# EAGLE schematic Board (EAGLE 7.5.0)
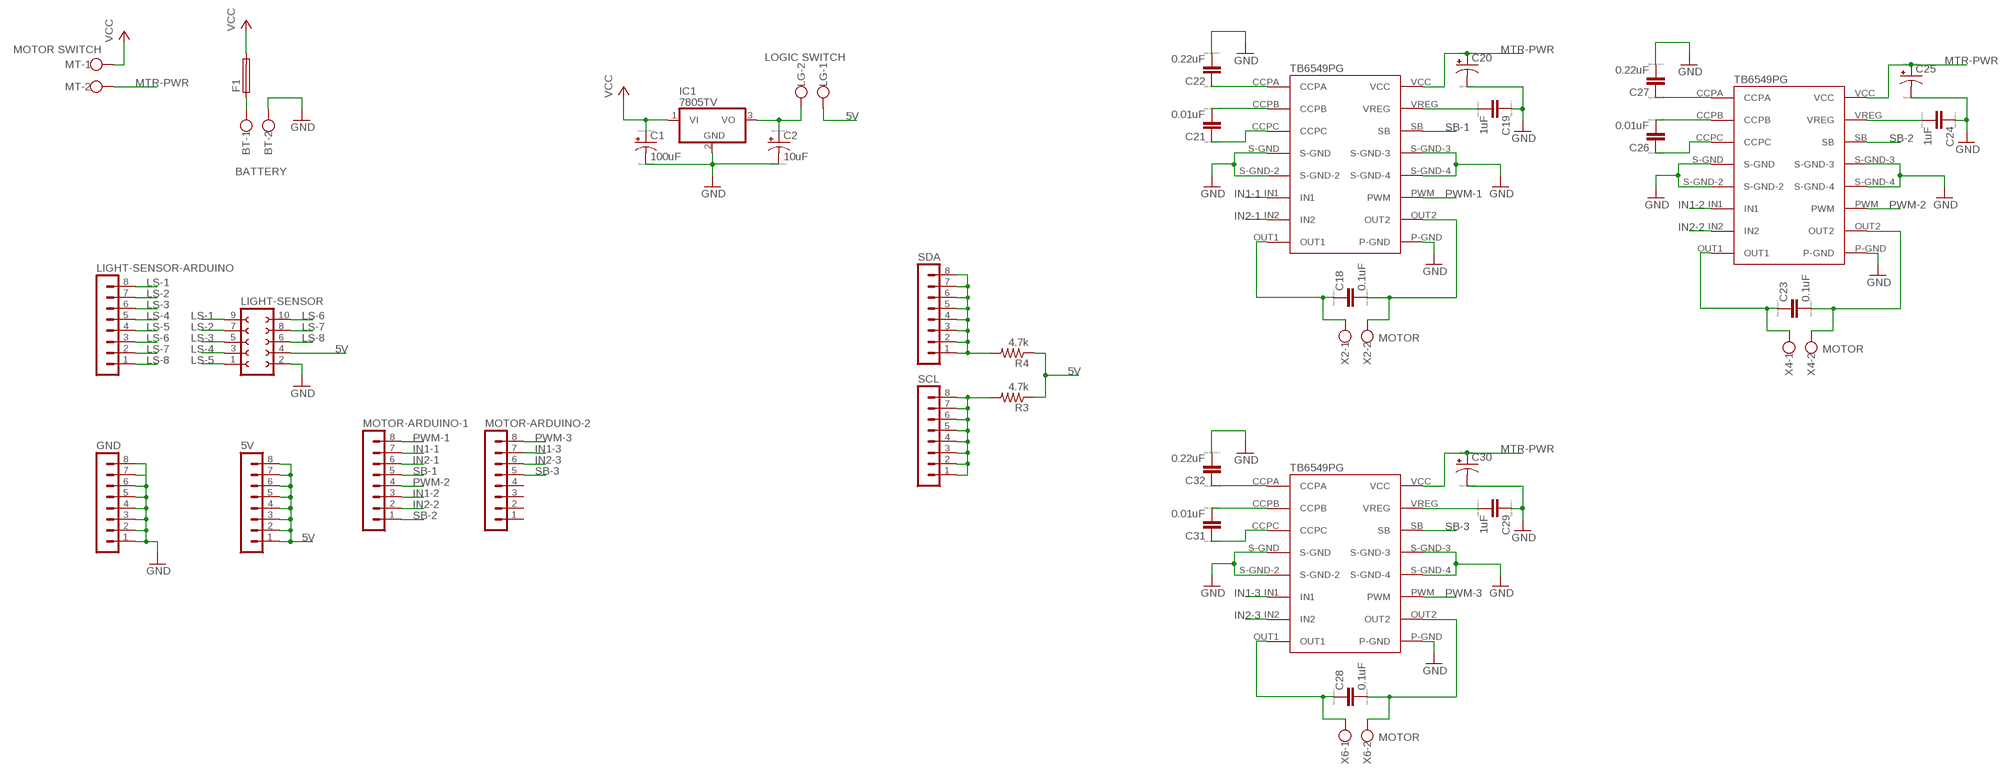
[diagram p0: schematic, sheet 1]

## Parts
5V  MA08-1  [MA08-1]
BT  W237-102  [W237-102]
C1  100uF  CPOL-USE3.5-8  [E3,5-8]
C2  10uF  CPOL-USE3.5-8  [E3,5-8]
C18  0.1uF  CYYC7B5  [YC7B5]
C19  1uF  CYYC7B5  [YC7B5]
C20  CPOL-USE3.5-8  [E3,5-8]
C21  0.01uF  CYYC7B5  [YC7B5]
C22  0.22uF  CYYC7B5  [YC7B5]
C23  0.1uF  CYYC7B5  [YC7B5]
C24  1uF  CYYC7B5  [YC7B5]
C25  CPOL-USE3.5-8  [E3,5-8]
C26  0.01uF  CYYC7B5  [YC7B5]
C27  0.22uF  CYYC7B5  [YC7B5]
C28  0.1uF  CYYC7B5  [YC7B5]
C29  1uF  CYYC7B5  [YC7B5]
C30  CPOL-USE3.5-8  [E3,5-8]
C31  0.01uF  CYYC7B5  [YC7B5]
C32  0.22uF  CYYC7B5  [YC7B5]
F1  GSH15  [GSH15]
GND  MA08-1  [MA08-1]
IC1  7805TV  [TO220V]
LG  W237-102  [W237-102]
LIGHT-SENSOR  FE05-2  [FE05-2]
LIGHT-SENSOR-ARDUINO  MA08-1  [MA08-1]
MOTOR-ARDUINO-1  MA08-1  [MA08-1]
MOTOR-ARDUINO-2  MA08-1  [MA08-1]
MT  W237-102  [W237-102]
R3  4.7k  R-US_0207/10  [0207/10]
R4  4.7k  R-US_0207/10  [0207/10]
SCL  MA08-1  [MA08-1]
SDA  MA08-1  [MA08-1]
U$4  TB6549PG  [TB6549PG]
U$5  TB6549PG  [TB6549PG]
U$6  TB6549PG  [TB6549PG]
X2  W237-102  [W237-102]
X4  W237-102  [W237-102]
X6  W237-102  [W237-102]

## Nets
1: C2.+ IC1.3(VO) LG.2
5V: 5V.1 5V.2 5V.3 5V.4 5V.5 5V.6 5V.7 5V.8 LG.1 LIGHT-SENSOR.4 R3.1 R4.1
GND: BT.2 C1.- C2.- C19.1 C20.- C22.2 C24.1 C25.- C27.2 C29.1 C30.- C32.2 GND.1 GND.2 GND.3 GND.4 GND.5 GND.6 GND.7 GND.8 IC1.2(GND) LIGHT-SENSOR.2 U$4.P-GND U$4.S-GND U$4.S-GND-2 U$4.S-GND-3 U$4.S-GND-4 U$5.P-GND U$5.S-GND U$5.S-GND-2 U$5.S-GND-3 U$5.S-GND-4 U$6.P-GND U$6.S-GND U$6.S-GND-2 U$6.S-GND-3 U$6.S-GND-4
IN1-1: MOTOR-ARDUINO-1.7 U$4.IN1
IN1-2: MOTOR-ARDUINO-1.3 U$5.IN1
IN1-3: MOTOR-ARDUINO-2.7 U$6.IN1
IN2-1: MOTOR-ARDUINO-1.6 U$4.IN2
IN2-2: MOTOR-ARDUINO-1.2 U$5.IN2
IN2-3: MOTOR-ARDUINO-2.6 U$6.IN2
LS-1: LIGHT-SENSOR-ARDUINO.8 LIGHT-SENSOR.9
LS-2: LIGHT-SENSOR-ARDUINO.7 LIGHT-SENSOR.7
LS-3: LIGHT-SENSOR-ARDUINO.6 LIGHT-SENSOR.5
LS-4: LIGHT-SENSOR-ARDUINO.5 LIGHT-SENSOR.3
LS-5: LIGHT-SENSOR-ARDUINO.4 LIGHT-SENSOR.1
LS-6: LIGHT-SENSOR-ARDUINO.3 LIGHT-SENSOR.10
LS-7: LIGHT-SENSOR-ARDUINO.2 LIGHT-SENSOR.8
LS-8: LIGHT-SENSOR-ARDUINO.1 LIGHT-SENSOR.6
MTR-PWR: C20.+ C25.+ C30.+ MT.2 U$4.VCC U$5.VCC U$6.VCC
N$3: BT.1 F1.1
N$5: R3.2 SCL.1 SCL.2 SCL.3 SCL.4 SCL.5 SCL.6 SCL.7 SCL.8
N$6: R4.2 SDA.1 SDA.2 SDA.3 SDA.4 SDA.5 SDA.6 SDA.7 SDA.8
N$24: C22.1 U$4.CCPA
N$25: C21.2 U$4.CCPB
N$26: C21.1 U$4.CCPC
N$27: C18.2 U$4.OUT2 X2.2
N$28: C18.1 U$4.OUT1 X2.1
N$29: C19.2 U$4.VREG
N$30: C27.1 U$5.CCPA
N$31: C26.2 U$5.CCPB
N$32: C26.1 U$5.CCPC
N$33: C23.2 U$5.OUT2 X4.2
N$34: C23.1 U$5.OUT1 X4.1
N$35: C24.2 U$5.VREG
N$36: C32.1 U$6.CCPA
N$37: C31.2 U$6.CCPB
N$38: C31.1 U$6.CCPC
N$39: C28.2 U$6.OUT2 X6.2
N$40: C28.1 U$6.OUT1 X6.1
N$41: C29.2 U$6.VREG
PWM-1: MOTOR-ARDUINO-1.8 U$4.PWM
PWM-2: MOTOR-ARDUINO-1.4 U$5.PWM
PWM-3: MOTOR-ARDUINO-2.8 U$6.PWM
SB-1: MOTOR-ARDUINO-1.5 U$4.SB
SB-2: MOTOR-ARDUINO-1.1 U$5.SB
SB-3: MOTOR-ARDUINO-2.5 U$6.SB
VCC: C1.+ F1.2 IC1.1(VI) MT.1
Unconnected: MOTOR-ARDUINO-2.1 MOTOR-ARDUINO-2.2 MOTOR-ARDUINO-2.3 MOTOR-ARDUINO-2.4

## Notes on the sheet
- MOTOR SWITCH | LOGIC SWITCH
- BATTERY
- MOTOR
- MOTOR
- MOTOR

## Library data of the parts
5V GND LIGHT-SENSOR-ARDUINO MOTOR-ARDUINO-1 MOTOR-ARDUINO-2 SCL SDA = con-lstb:MA08-1: PIN HEADER; OC_FARNELL: unknown; OC_NEWARK: unknown
BT LG MT X2 X4 X6 = con-wago-500:W237-102: WAGO SCREW CLAMP; MPN: 237-102; OC_FARNELL: unknown; OC_NEWARK: 70K9898
C1 C2 C20 C25 C30 = resistor:CPOL-US: POLARIZED CAPACITOR, American symbol
C18 C19 C21-C24 C26-C29 C31 C32 = resistor:CY: Y CAPACITOR for power line
F1 = fuse:GSH15: FUSE HOLDER grid 15mm, 19649 Wickmann; MPN: 64900001039; OC_FARNELL: 1271673; OC_NEWARK: 02P0318
IC1 = linear:78*: Positive VOLTAGE REGULATOR Source: http://cache.national.com/ds/LM/LM78L05.pdf http://www.fairchildsemi.com/ds/LM/LM7805.pdf
LIGHT-SENSOR = con-lsta:FE05-2: FEMALE HEADER; OC_FARNELL: unknown; OC_NEWARK: unknown
R3 R4 = resistor:R-US_: RESISTOR, American symbol
U$4-U$6 = JY-TB6549PG:TB6549PG